# EAGLE design usbdacpcm2704_1_1 (EAGLE 5.11)
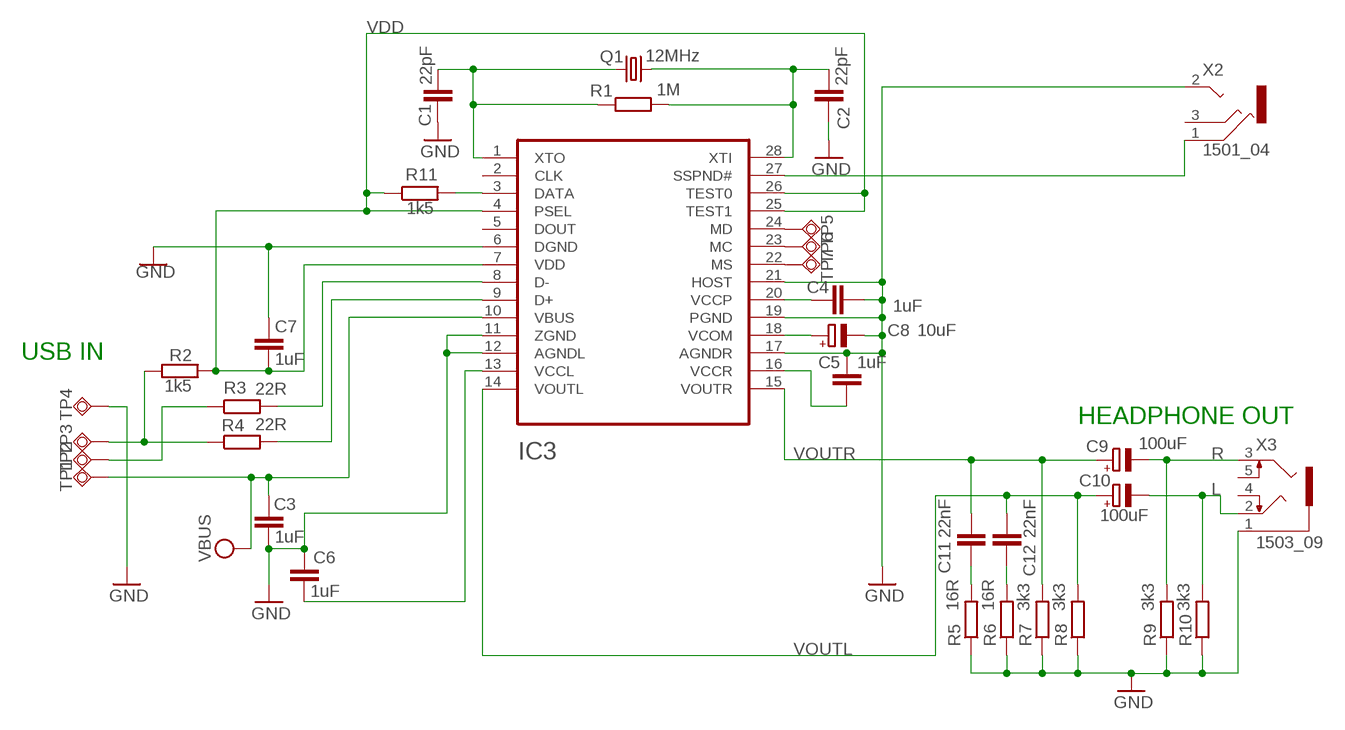
[diagram p0: schematic, sheet 1]

## Parts
C1  22pF  C-EUC0805  [C0805]
C2  22pF  C-EUC0805  [C0805]
C3  1uF  C-EUC0805  [C0805]
C4  1uF  C-EUC0805  [C0805]
C5  1uF  C-EUC0805  [C0805]
C6  1uF  C-EUC0805  [C0805]
C7  1uF  C-EUC0805  [C0805]
C8  10uF  CPOL-EUB/3528-21R  [B/3528-21R]
C9  100uF  CPOL-EUB/3528-21R  [B/3528-21R]
C10  100uF  CPOL-EUB/3528-21R  [B/3528-21R]
C11  22nF  C-EUC0805  [C0805]
C12  22nF  C-EUC0805  [C0805]
IC3  PCM2705  [SSOP28]
Q1  12MHz  CRYSTALHC49U-V  [HC49U-V]
R1  1M  R-EU_R0805  [R0805]
R2  1k5  R-EU_R1206  [R1206]
R3  22R  R-EU_R0805  [R0805]
R4  22R  R-EU_R0805  [R0805]
R5  16R  R-EU_R0805  [R0805]
R6  16R  R-EU_R0805  [R0805]
R7  3k3  R-EU_R0805  [R0805]
R8  3k3  R-EU_R0805  [R0805]
R9  3k3  R-EU_R0805  [R0805]
R10  3k3  R-EU_R0805  [R0805]
R11  1k5  R-EU_R0805  [R0805]
TP1  TPSQTP12SQ  [TP12SQ]
TP2  TPSQTP12SQ  [TP12SQ]
TP3  TPSQTP12SQ  [TP12SQ]
TP4  TPSQTP12SQ  [TP12SQ]
TP5  TPSQTP12SQ  [TP12SQ]
TP6  TPSQTP12SQ  [TP12SQ]
TP7  TPSQTP12SQ  [TP12SQ]
X2  1501_04  [1501_05]
X3  1503_09  [1503_09]

## Nets
DATA: IC3.3(DATA) R11.2
GND: C1.2 C2.2 C3.2 C4.2 C5.2 C6.1 C7.1 C8.- IC3.6(DGND) IC3.11(ZGND) IC3.12(AGNDL) IC3.17(AGNDR) IC3.19(PGND) IC3.21(HOST) R5.1 R6.1 R7.1 R8.1 R9.1 R10.1 TP4.TP X2.2 X3.1
L: C10.- R10.2 X3.2
N$1: IC3.8(D-) R3.2
N$2: IC3.9(D+) R4.2
N$3: R3.1 TP2.TP
N$4: C6.2 IC3.13(VCCL)
N$5: R2.1 R4.1 TP3.TP
N$6: IC3.24(MD) TP5.TP
N$7: IC3.23(MC) TP6.TP
N$8: IC3.22(MS) TP7.TP
N$26: C11.2 R5.2
N$27: C12.2 R6.2
R: C9.- R9.2 X3.3
SUSPEND: IC3.27(SSPND#) X2.1
VBUS: C3.1 IC3.10(VBUS) TP1.TP
VCCR: C5.1 IC3.16(VCCR)
VCOM: C8.+ IC3.18(VCOM)
VCPP: C4.1 IC3.20(VCCP)
VDD: C7.2 IC3.4(PSEL) IC3.7(VDD) IC3.25(TEST1) IC3.26(TEST0) R2.2 R11.1
VOUTL: C10.+ C12.1 IC3.14(VOUTL) R8.2
VOUTR: C9.+ C11.1 IC3.15(VOUTR) R7.2
XTI: C2.1 IC3.28(XTI) Q1.2 R1.2
XTO: C1.1 IC3.1(XTO) Q1.1 R1.1
Unconnected: IC3.2(CLK) IC3.5(DOUT) X2.3 X3.4 X3.5

## Notes on the sheet
- USB IN
- HEADPHONE OUT

## Library data of the parts
C1-C7 C11 C12 = rcl:C-EU: CAPACITOR, European symbol
C8-C10 = rcl:CPOL-EU: POLARIZED CAPACITOR, European symbol
IC3 = PCM2705:PCM2705
Q1 = crystal:CRYSTAL: CRYSTAL
R1-R11 = rcl:R-EU_: RESISTOR, European symbol
TP1-TP7 = testpad:TPSQ: Test pad
X2 = con-lumberg:1501_0*: Jack connectors according to JISC 6560, 2.5 mm Klinkensteckverbinder nach JISC 6560, 2,5 mm Source: http://www.lumberg.com/Produkte/PDFs/1501_05.pdfedit 1501_03 http://www.lumberg.com/Produkte/PDFs/1501_06.pdf; OC_FARNELL: 1216977; OC_NEWARK: unknown
X3 = con-lumberg:1503_09: Jack connectors according to JISC 6560, 3.5 mm Klinkeneinbaukupplung nach JISC 6560, 3,5 mm, 3-polig/ stereo, abgewinkelte Ausführung, mit 2 Öffnern und Lötaugen, für Leiterplatten Rückseitenmontage Source: http://www.lumberg.com/Produkte/PDFs/1503_09.pdf

## Board
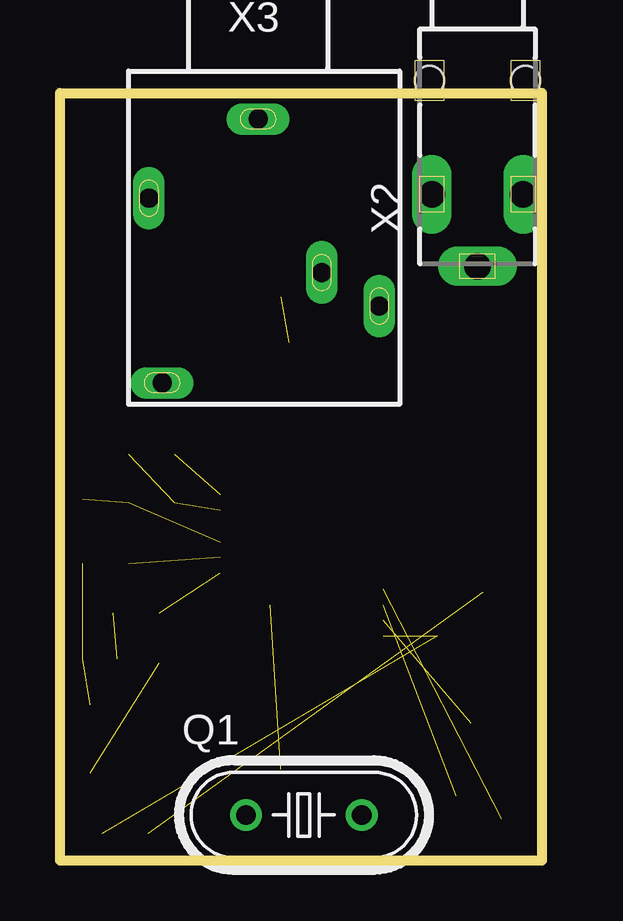
[diagram p1: board, top side]
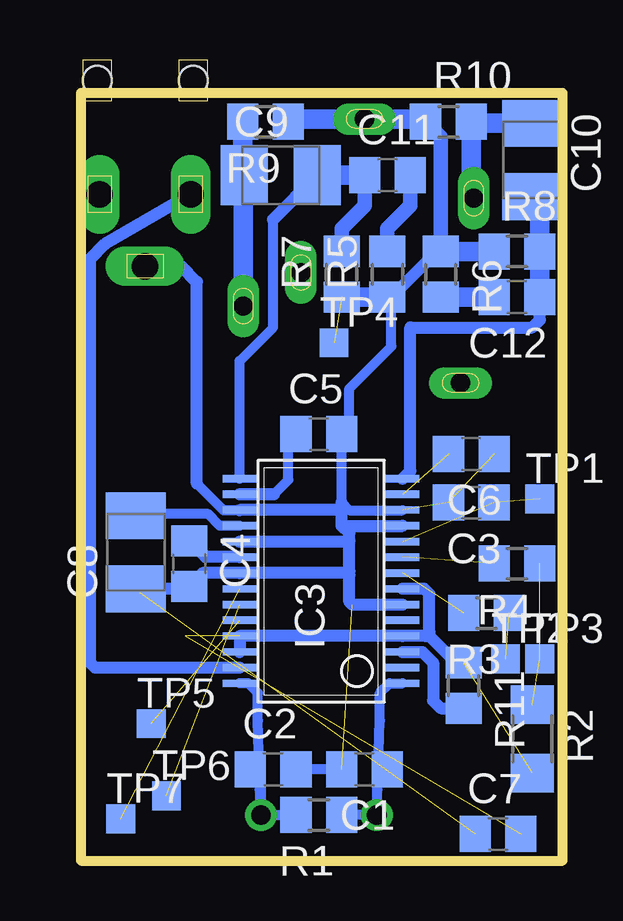
[diagram p2: board, bottom side, seen from below]

Size 20.08 x 32 mm. Coordinates in mm from the lower left corner, seen from the top.
Outline: 0,32 20.08,32 20.08,0 0,0 0,32
Copper layers (1*16): Top 0.035mm / dielectric 1.5mm / Bottom 0.035mm
Design rules "default": minimum track width 10mil, minimum drill 24mil, track to track 8mil, track to pad 8mil, pad to pad 8mil, via to via 8mil, smd to smd 8mil, copper to edge 40mil, drill to drill 8mil, minimum pad ring 10mil, minimum via ring 8mil, stop-mask expansion 4mil, vias tented up to drill 0mil, thermal gap 10mil

### Footprints (pad centres in the part's own frame; a part is rotated, then mirrored left to right if it is on the bottom)
C0805 = smd 1.3 x 1.5: 1 -0.95,0; 2 0.95,0
B/3528-21R = smd 1.95 x 2.5: + 1.525,0; - -1.525,0
SSOP28 = smd 0.305 x 1.397: 1 -4.039,-2.856; 2 -3.384,-2.856; 3 -2.729,-2.856; 4 -2.063,-2.856; 5 -1.409,-2.856; 6 -0.763,-2.856; 7 -0.099,-2.856; 8 0.556,-2.856; 9 1.222,-2.856; 10 1.866,-2.856; 11 2.531,-2.856; 12 3.186,-2.856; 13 3.841,-2.856; 14 4.496,-2.856; 15 4.496,3.937; 16 3.841,3.937; 17 3.186,3.937; 18 2.531,3.937; 19 1.866,3.937; 20 1.222,3.937; 21 0.556,3.937; 22 -0.099,3.937; 23 -0.763,3.937; 24 -1.409,3.937; 25 -2.063,3.937; 26 -2.729,3.937; 27 -3.384,3.937; 28 -4.039,3.937
HC49U-V = drill 0.813 round: 1 -2.413,0; 2 2.413,0
R0805 = smd 1.3 x 1.5: 1 -0.95,0; 2 0.95,0
R1206 = smd 1.6 x 1.803: 1 -1.422,0; 2 1.422,0
TP12SQ = smd 1.2 x 1.2: TP 0,0
1501_05 = drill 1.1 pad 1.4 long: 1 -1.9,-8.5; 2 0,-11.5; 3 1.9,-8.5 | hole 1.2: -2,-3.75; 2,-3.75
1503_09 = drill 0.8 pad 1.2 long: 1 0,-2.1; 2 -4.55,-5.4; 3 5.05,-9.9; 4 -4,-13.1; 5 2.65,-8.5

### Placement (x,y rotation side)
C1  8.26,3.81 180 bottom
C2  12.06,3.81 0 bottom
C3  3.81,14.92 180 bottom
C4  15.56,12.38 270 bottom
C5  10.16,17.78 0 bottom
C6  3.8,16.95 180 bottom
C7  2.7,1.11 0 bottom
C8  17.78,12.86 90 bottom
C9  11.75,28.57 0 bottom
C10  1.27,29.21 270 bottom
C11  7.3,28.57 0 bottom
C12  1.91,23.5 180 bottom
IC3  9.53,11.43 90 bottom
Q1  10.16,1.91 0 top
R1  10.16,1.91 180 bottom
R2  1.27,5.08 270 bottom
R3  3.17,10.32 180 bottom
R4  1.91,12.38 180 bottom
R5  7.3,24.45 90 bottom
R6  5.08,24.45 270 bottom
R7  9.21,24.45 90 bottom
R8  1.91,25.4 0 bottom
R9  12.38,30.8 180 bottom
R10  4.76,30.8 0 bottom
R11  4.13,7.3 270 bottom
TP1  0.95,15.08 0 bottom
TP2  2.38,8.41 0 bottom
TP3  0.95,8.41 0 bottom
TP4  9.53,21.59 0 bottom
TP5  17.14,5.71 0 bottom
TP6  16.51,2.7 0 bottom
TP7  18.41,1.75 0 bottom
X2  17.39,36.28 0 top
X3  8.26,33.02 0 top

### Tracks (layer width: path | path; a pad name or v marks a point on that pad's centre or on a via)
DATA
  Bottom 0.508: IC3.3 5.84,8.7 5.4,8.26 5.4,6.67 5.08,6.35 R11.2
GND  (5 unrouted)
  Bottom 0.406: IC3.12 6.68,14.61 8.89,14.61 9.21,14.93 C5.2 8.89,18.1 8.89,19.68 7.14,21.43 7.14,23.5 | C1.2 C2.2 | IC3.17 13.47,14.61 14.13,14.61 15.24,15.72
  Bottom 0.508: R5.1 7.14,23.5 5.56,25.08 5.39,25.08 R6.1 | 9.2,13.96 IC3.11 | 9.2,13.96 9.21,13.97 9.21,14.61 | 9.21,14.61 9.21,14.92 9.21,14.93 | 8.97,11.99 IC3.21 15,11.99 C4.2 15.66,11.33 C8.- 17.62,11.17 | 8.97,11.99 8.89,12.06 8.89,13.34 | 8.89,13.34 8.89,13.65 9.2,13.96 | IC3.17 9.22,14.62 9.21,14.61 | IC3.19 8.93,13.3 8.89,13.34 | X2.2 15.89,24.78 15.24,24.13 15.24,15.72 | IC3.6 8.76,10.67 8.89,10.79 8.89,11.91 8.97,11.99
  Bottom 0.61: R10.1 5.08,30.16 R6.1
  Bottom 0.813: R10.1 5.71,30.92 X3.1 11.31,30.92 arc-90 R9.1 | R8.1 R6.1 | R5.1 R7.1
L
  Bottom 0.813: 3.71,28.2 X3.2 3.81,27.62 R10.2 3.75,30.73 C10.-
N$1  (1 unrouted)
N$2  (1 unrouted)
N$3  (1 unrouted)
N$4  (1 unrouted)
N$5  (2 unrouted)
N$6  (1 unrouted)
N$7  (1 unrouted)
N$8  (1 unrouted)
N$26
  Bottom 0.61: C11.2 6.35,27.3 7.3,26.35 R5.2
N$27
  Bottom 0.813: C12.2 R6.2
R
  Bottom 0.813: R9.2 13.33,28.64 arc-90 C9.- arc-90 13.3,28.54 X3.3
SUSPEND
  Bottom 0.508: IC3.27 19.48,8.05 19.68,8.26 19.68,25.08 19.05,25.72 X2.1
VBUS  (2 unrouted)
VCCR
  Bottom 0.406: 12.03,15.27 11.43,15.88 11.43,17.46 C5.1
  Bottom 0.508: 12.03,15.27 IC3.16
VCOM
  Bottom 0.406: IC3.18 14.28,13.96 14.76,14.45 17.72,14.45 C8.+
VCPP
  Bottom 0.508: IC3.20 14.88,12.65 C4.1
VDD  (3 unrouted)
  Bottom 0.508: IC3.26 IC3.25 IC3.4 5.71,9.37 5.64,9.45 | IC3.7 5.78,11.33 5.56,11.11 5.56,9.53 5.64,9.45 | R11.1 4.44,8.25 5.64,9.45
VOUTL
  Bottom 0.508: C12.1 0.95,22.54 1.27,22.23 6.35,22.23 6.35,16.25 IC3.14
  Bottom 0.813: C12.1 R8.2 0.95,27.37 C10.+
VOUTR
  Bottom 0.406: IC3.15 13.46,20.83 12.06,22.23 12.06,26.73
  Bottom 0.508: 12.06,26.73 C9.+
  Bottom 0.61: C11.1 8.26,27.3 9.21,26.35 R7.2
  Bottom 0.813: C9.+ C11.1
XTI
  Bottom 0.406: IC3.28 13.11,7.39 12.7,6.99 12.7,5.84 Q1.2 | Q1.2 R1.2 | Q1.2 12.57,4.25 C2.1
XTO
  Bottom 0.406: IC3.1 7.21,7.39 7.62,6.99 7.62,5.84 Q1.1 | Q1.1 R1.1 | Q1.1 7.75,4.25 C1.1